# EAGLE design Digital light sensor v0.9b (EAGLE 6.2)
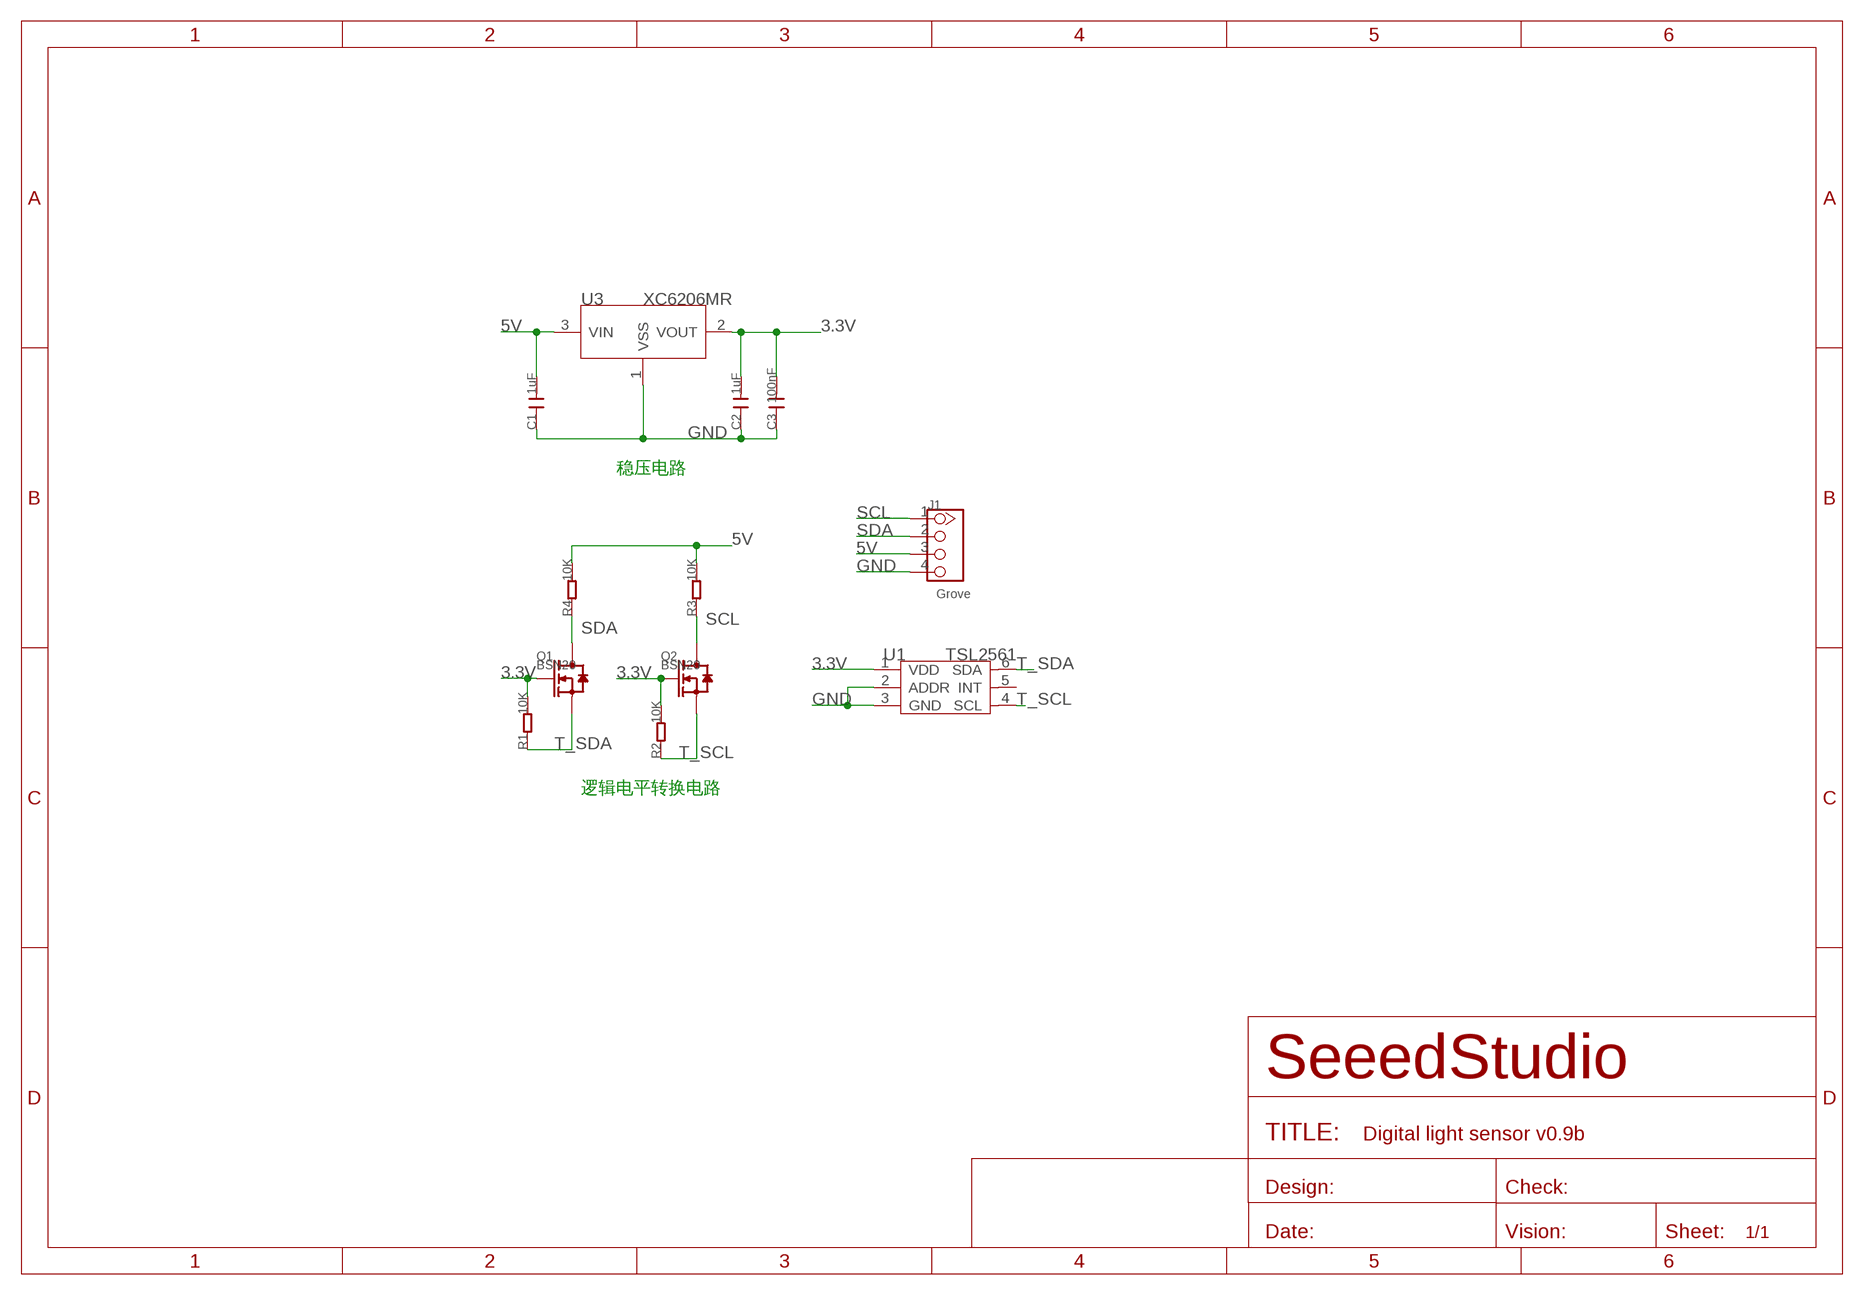
[diagram p0: schematic, sheet 1]

## Parts
C1  1uF  C-0603  [C0603]
C2  1uF  C-0603  [C0603]
C3  100nF  C-0603  [C0603]
J1  Grove  TWIG-4P-2.0-2.0  [4P-2.0]
Q1  BSN20  MOSFET-N'SOT23'  [SOT23]
Q2  BSN20  MOSFET-N'SOT23'  [SOT23]
R1  10K  R-0603  [R0603]
R2  10K  R-0603  [R0603]
R3  10K  R-0603  [R0603]
R4  10K  R-0603  [R0603]
U1  TSL2561  TSL2561T  [TMB-6]
U3  XC6206MR  [SOT23]

## Nets
3.3V: C2.2 C3.2 Q1.1(G) Q2.1(G) R1.2 R2.2 U1.1(VDD) U3.2(VOUT)
5V: C1.2 J1.3 R3.2 R4.2 U3.3(VIN)
GND: C1.1 C2.1 C3.1 J1.4 U1.2(ADDR) U1.3(GND) U3.1(VSS)
SCL: J1.1 Q2.3(D) R3.1
SDA: J1.2 Q1.3(D) R4.1
T_SCL: Q2.2(S) R2.1 U1.4(SCL)
T_SDA: Q1.2(S) R1.1 U1.6(SDA)
Unconnected: U1.5(INT)

## Notes on the sheet
- 稳压电路
- 逻辑电平转换电路

## Library data of the parts
C1-C3 = Discrete:C*: Ceramic Capacitors
J1 = Connector:TWIG-4P-2.0
Q1 Q2 = Discrete:MOSFET-N: IRLL014: http://www.vishay.com/docs/91319/sihll014.pdf
R1-R4 = Discrete:R*
U1 = template:TSL2561: Light-TO-Digital Converter
U3 = IC:XC6206: LOW ESR Cap.Compatible Positive Voltage Regulators

## Board
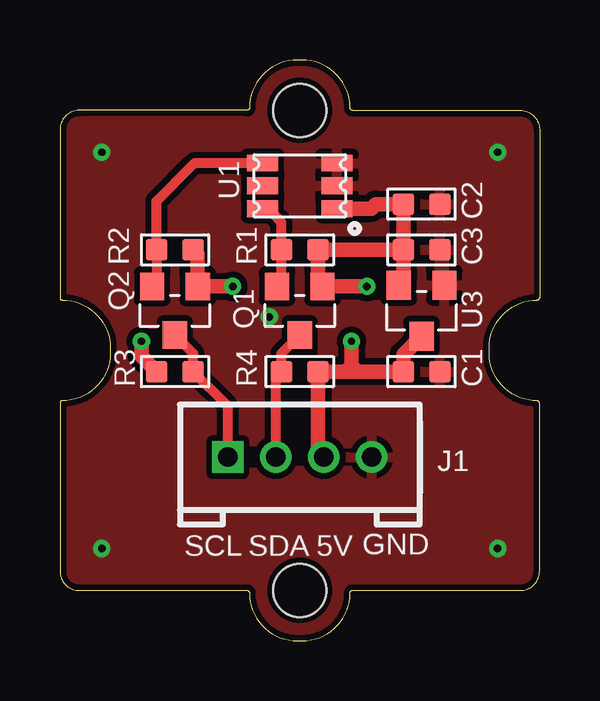
[diagram p1: board, top side]
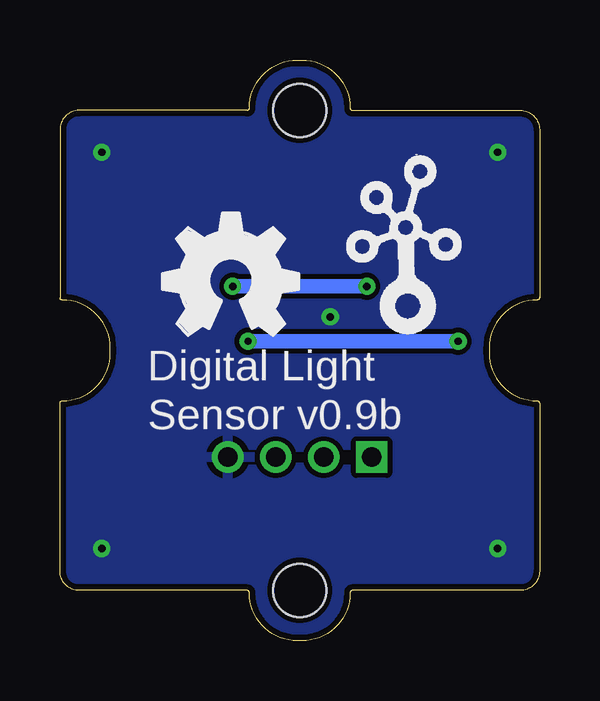
[diagram p2: board, bottom side, seen from below]

Size 20 x 24.2 mm. Coordinates in mm from the lower left corner, seen from the top.
Copper layers (1*16): Top 0.035mm / dielectric 1.5mm / Bottom 0.035mm
Design rules: minimum track width 10mil, minimum drill 12mil, track to track 8mil, track to pad 8mil, pad to pad 8mil, via to via 8mil, smd to smd 0mil, copper to edge 10mil, drill to drill 8mil, minimum pad ring 10mil, minimum via ring 8mil, stop-mask expansion 4mil, vias tented up to drill 25mil, thermal gap 10mil

### Footprints (pad centres in the part's own frame; a part is rotated, then mirrored left to right if it is on the bottom)
C0603 = smd 0.889 x 0.889: 1 -0.762,0; 2 0.762,0
4P-2.0 = drill 0.8 pad 1.27 square: 1 -3,0 | drill 0.8 pad 1.27: 2 -1,0; 3 1,0; 4 3,0
SOT23 = smd 1.016 x 1.143: 1 -0.95,-1.016; 2 0.95,-1.016; 3 0,1.016
R0603 = smd 0.889 x 0.889: 1 -0.762,0; 2 0.762,0
TMB-6 = smd 1.3 x 0.7: 1 -1.55,0.95; 2 -1.55,0; 3 -1.55,-0.95; 4 1.55,-0.95; 5 1.55,0; 6 1.55,0.95
SOT23' = smd 1.016 x 1.2: 1 -0.95,-1.06; 2 0.95,-1.06; 3 0,1.06
1U-DIM-W/-DRILL = hole 2.2: 0,-10; 0,10

### Placement (x,y rotation side)
C1  15.08,11.21 180 top
C2  15.08,18.2 180 top
C3  15.08,16.29 180 top
J1  10,7.65 0 top
Q1  10,13.75 180 top
Q2  4.79,13.75 180 top
R1  10,16.29 0 top
R2  4.79,16.29 0 top
R3  4.79,11.21 180 top
R4  10,11.21 0 top
U1  10,18.96 180 top
U3  XC6206MR  [SOT23']  15.08,13.75 180 top
U$2  [1U-DIM-W/-DRILL]  10,12.1 0 top
U$3  [TWIGLOGO]  5.55,13.75 0 bottom
U$4  [OSHW_FILLX200_NOTEXT]  15.71,12.73 0 bottom

### Tracks (layer width: path | path; a pad name or v marks a point on that pad's centre or on a via)
3.3V  (via drill 0.3 pad 0.64)
  Top 0.61: v7.21,14.77 Q2.1 5.74,16.1 R2.2 | v12.79,14.77 Q1.1 10.76,14.96 R1.2 C3.2 | C3.2 14.32,15 U3.2 | C3.2 C2.2 13.18,18.2 12.99,18.01 U1.1
  Bottom 0.61: v7.21,14.77 v12.79,14.77
5V  (via drill 0.3 pad 0.64)
  Top 0.61: U3.3 14.32,11.93 C1.2 12.41,11.21 | 12.41,11.21 12.16,11.21 | 12.16,11.21 11.9,11.21 | 11.9,11.21 R4.2 10.76,7.89 J1.3 | v12.16,12.48 12.16,11.72 | 12.16,11.72 12.16,11.21 | v3.4,12.48 3.4,11.85 R3.2 | 12.16,11.72 12.16,11.46 | 12.16,11.46 11.9,11.21 | 12.16,11.72 12.16,11.46 | 12.16,11.46 12.41,11.21
  Bottom 0.61: v3.4,12.48 v12.16,12.48 v3.4,12.48
GND  (via drill 0.3 pad 0.64)
  other vias: 1.74,20.36 18.26,20.36 18.26,3.84 1.74,3.84 8.73,13.5
  pour Bottom: -0.79,24.8 20.8,24.8 20.8,-0.6 -0.79,-0.6
  pour Top (isolate 0.254): -0.79,24.8 20.8,24.8 20.8,-0.6 -0.79,-0.6
SCL
  Top 0.406: Q2.3 5.55,11.97 R3.1 7,9.77 J1.1
SDA
  Top 0.406: R4.1 9.24,11.97 Q1.3 | 9,10.97 R4.1 | J1.2 9,10.97 | 9,10.97 R4.1
T_SCL
  Top 0.406: Q2.2 4.03,14.96 R2.1 4.03,18.32 5.55,19.85 5.62,19.91 U1.4
T_SDA
  Top 0.406: Q1.2 9.11,14.77 9.24,14.89 R1.1 9.24,17.43 9.11,17.56 8.66,18.01 U1.6

### Text on the board
tPlace: SCL | SDA | 5V | GND
bPlace: Digital Light | Sensor v0.9b